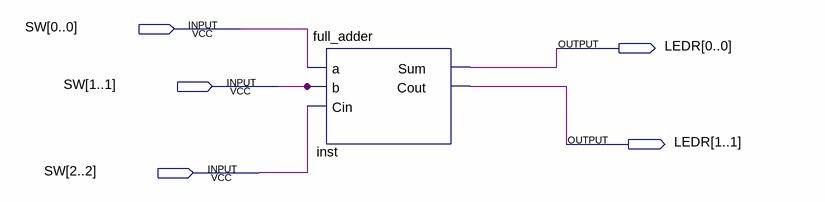
[diagram p0: schematic sheet]
// Quartus schematic full_adder1125.bdf as structural Verilog: 1 symbols, 5 pins
module full_adder1125 (
  input  [2:0] SW,
  output [1:0] LEDR
);

  full_adder inst (.a(SW[0]), .b(SW[1]), .Cin(SW[2]), .Sum(LEDR[0]), .Cout(LEDR[1]));
endmodule
